# EAGLE design Main (EAGLE 6.1)
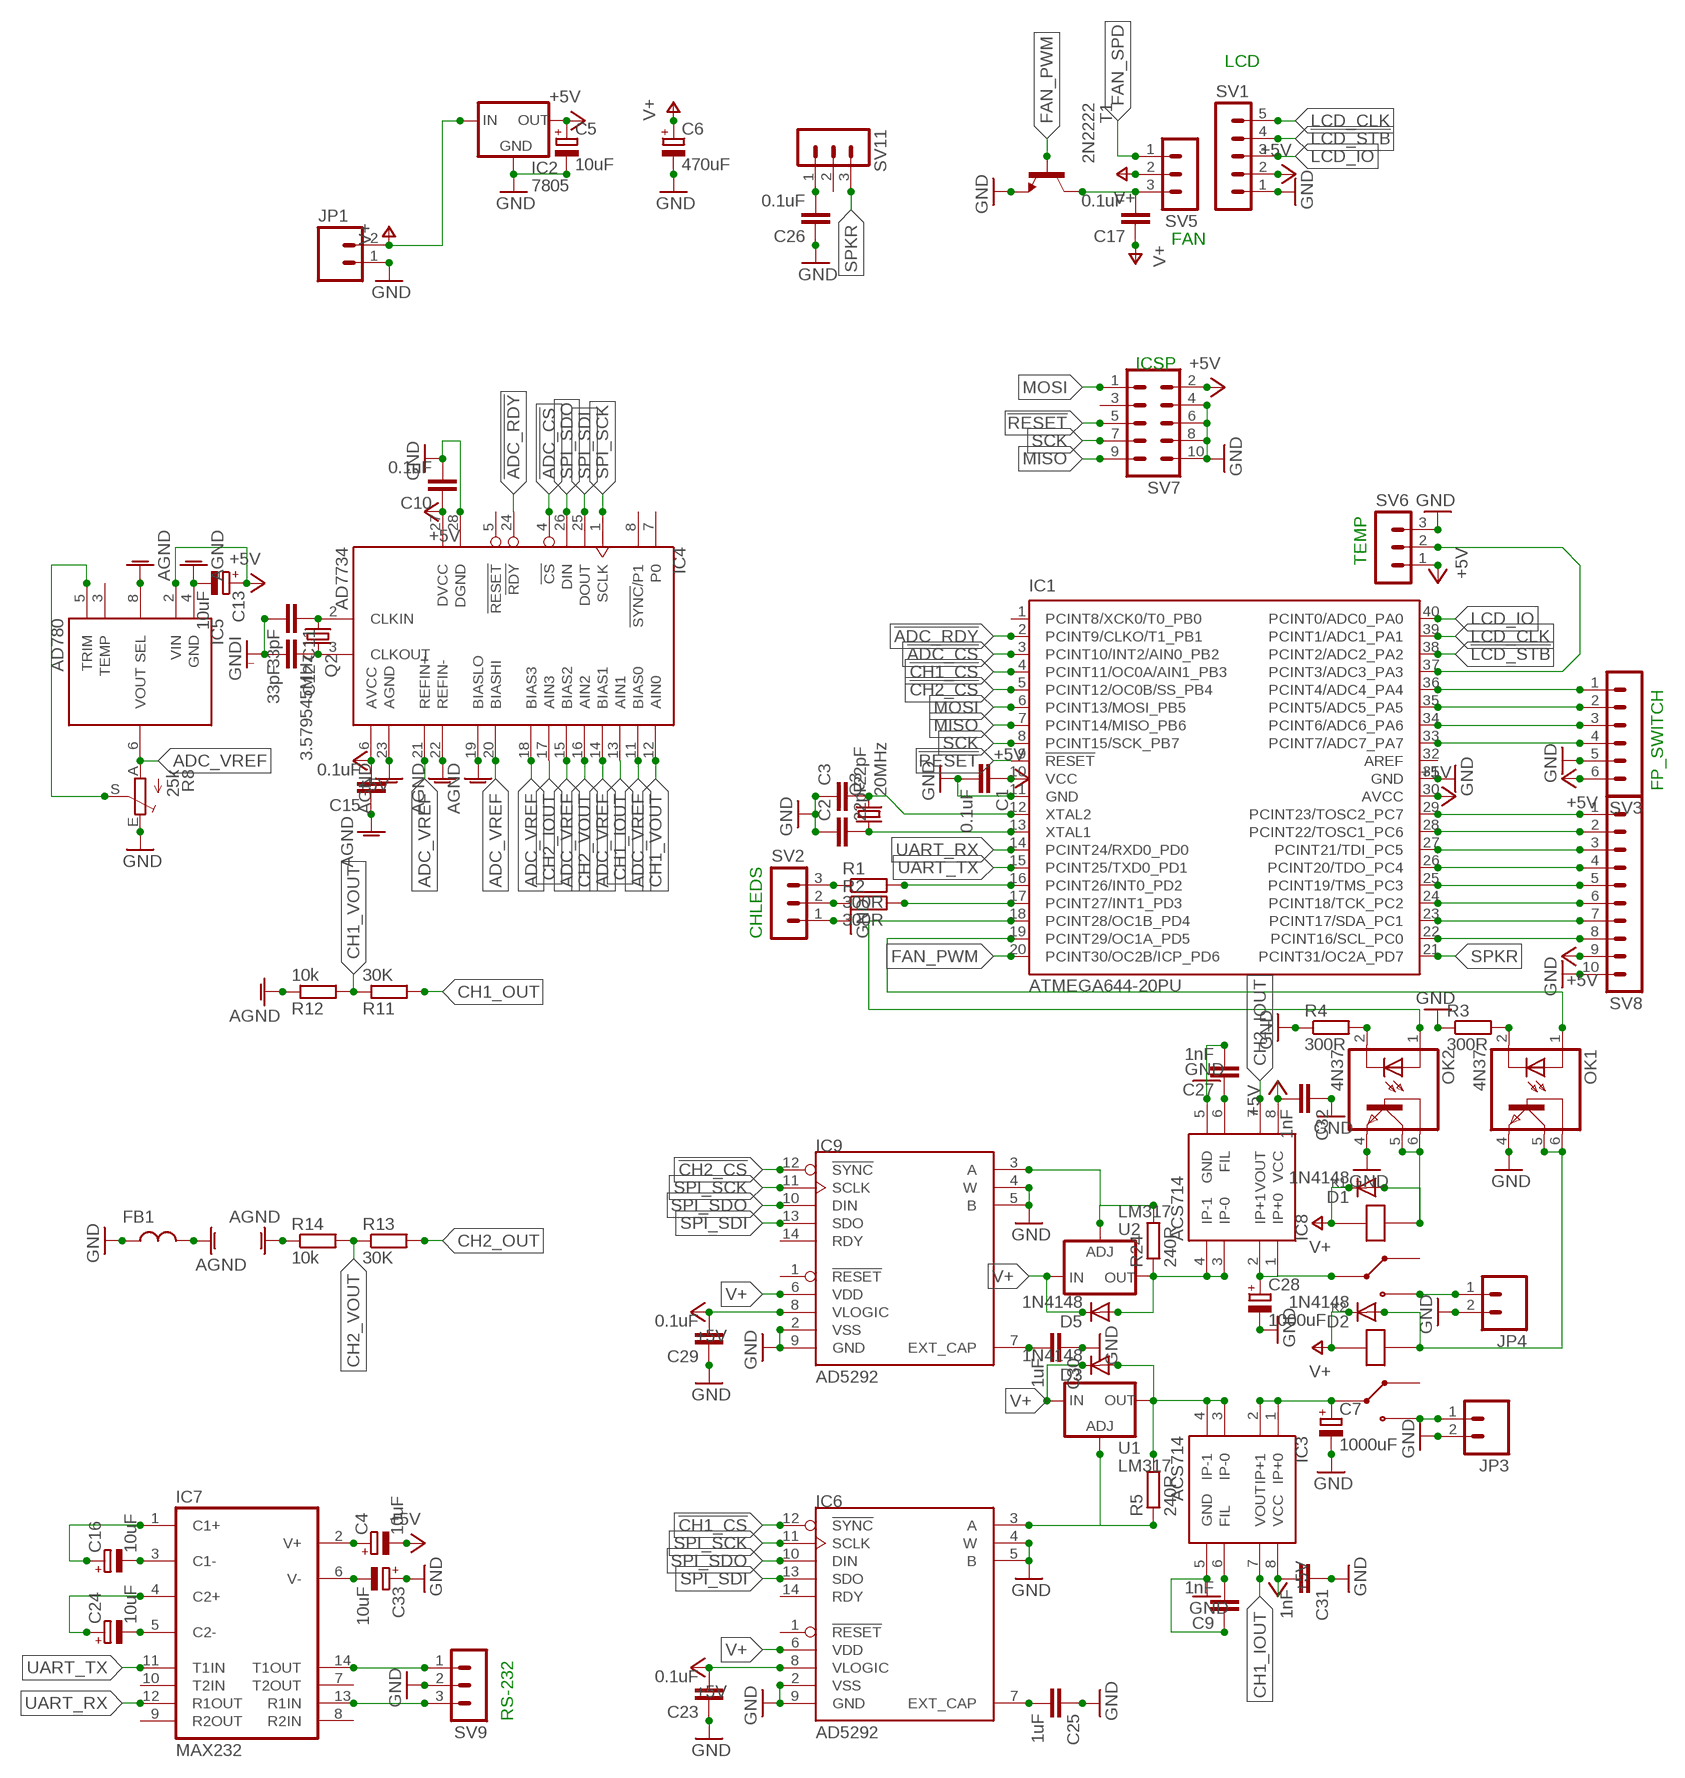
[diagram p0: schematic, sheet 1]

## Parts
C1  0.1uF  C-EUC2012  [C2012]
C2  22pF  C-EU025-024X044  [C025-024X044]
C3  22pF  C-EU025-024X044  [C025-024X044]
C4  10uF  CPOL-EUE2.5-5  [E2,5-5]
C5  10uF  CPOL-EUE2.5-5  [E2,5-5]
C6  470uF  CPOL-EUE5-10.5  [E5-10,5]
C7  1000uF  CPOL-EUE5-13  [E5-13]
C9  1nF  C-EUC2012  [C2012]
C10  0.1uF  C-EUC2012  [C2012]
C11  33pF  C-EUC2012  [C2012]
C12  33pF  C-EUC2012  [C2012]
C13  10uF  CPOL-EUE2.5-5  [E2,5-5]
C15  0.1uF  C-EUC2012  [C2012]
C16  10uF  CPOL-EUE2.5-5  [E2,5-5]
C17  0.1uF  C-EUC2012  [C2012]
C23  0.1uF  C-EUC2012  [C2012]
C24  10uF  CPOL-EUE2.5-5  [E2,5-5]
C25  1uF  C-EUC2012  [C2012]
C26  0.1uF  C-EUC2012  [C2012]
C27  1nF  C-EUC2012  [C2012]
C28  1000uF  CPOL-EUE5-13  [E5-13]
C29  0.1uF  C-EUC2012  [C2012]
C30  1uF  C-EUC2012  [C2012]
C31  1nF  C-EUC2012  [C2012]
C32  1nF  C-EUC2012  [C2012]
C33  10uF  CPOL-EUE2.5-5  [E2,5-5]
D1  1N4148  1N4148DO35-7  [DO35-7]
D2  1N4148  1N4148DO35-7  [DO35-7]
D3  1N4148  1N4148DO35-7  [DO35-7]
D5  1N4148  1N4148DO35-7  [DO35-7]
FB1  FERRITE2012  [R2012]
IC1  ATMEGA644-20PU  [DIL40]
IC2  7805  78MXXS  [78MXXS]
IC3  ACS714  ACS714SOIC8  [SOP08]
IC4  AD7734  AD7734TSSOP28  [TSSOP28]
IC5  AD780  [SOP08]
IC6  AD5292  AD5292TSSOP14  [TSSOP14]
IC7  MAX232  [DIL16]
IC8  ACS714  ACS714SOIC8  [SOP08]
IC9  AD5292  AD5292TSSOP14  [TSSOP14]
JP1  M023.5MM  [SCREWTERMINAL-3.5MM-2]
JP3  M023.5MM  [SCREWTERMINAL-3.5MM-2]
JP4  M023.5MM  [SCREWTERMINAL-3.5MM-2]
K1  SRD-24VDC-SL-C  [SRD-24VDC-SL-C]
K2  SRD-24VDC-SL-C  [SRD-24VDC-SL-C]
OK1  4N37  [DIL06]
OK2  4N37  [DIL06]
Q2  3.579545MHz  CRYSTALHC49S  [HC49/S]
Q3  20MHz  CRYSTALHC49S  [HC49/S]
R1  300R  R-EU_R2012  [R2012]
R2  300R  R-EU_R2012  [R2012]
R3  300R  R-EU_R2012  [R2012]
R4  300R  R-EU_R2012  [R2012]
R5  240R  R-EU_0204/7  [0204/7]
R8  25k  TRIM_EU-B25P  [B25P]
R11  30K  R-EU_R2012  [R2012]
R12  10k  R-EU_R2012  [R2012]
R13  30K  R-EU_R2012  [R2012]
R14  10k  R-EU_R2012  [R2012]
R24  240R  R-EU_0204/7  [0204/7]
SV1  MA05-1  [MA05-1]
SV2  MA03-1  [MA03-1]
SV3  MA06-1  [MA06-1]
SV5  MA03-1  [MA03-1]
SV6  MA03-1  [MA03-1]
SV7  MA05-2  [MA05-2]
SV8  MA10-1  [MA10-1]
SV9  MA03-1  [MA03-1]
SV11  MA03-1  [MA03-1]
T1  2N2222  -NPN-TO92  [TO92]
U1  LM317  V_REG_317SINK  [TO220-ADJ]
U2  LM317  V_REG_317SINK  [TO220-ADJ]

## Nets
!ADC_CS!: IC1.3(PCINT10/INT2/AIN0_PB2) IC4.4(!CS!)
!ADC_RDY!: IC1.2(PCINT9/CLKO/T1_PB1) IC4.24(!RDY!)
!CH1_CS!: IC1.4(PCINT11/OC0A/AIN1_PB3) IC6.12(!SYNC!)
!CH2_CS!: IC1.5(PCINT12/OC0B/SS_PB4) IC9.12(!SYNC!)
!LCD_STB!: IC1.38(PCINT2/ADC2_PA2) SV1.4
!RESET!: IC1.9(!RESET) SV7.5
+5V: C1.1 C4.- C5.+ C10.1 C13.+ C15.2 C23.2 C29.2 C31.2 C32.2 IC1.10(VCC) IC1.30(AVCC) IC2.OUT IC3.8(VCC) IC4.6(AVCC) IC4.27(DVCC) IC5.2(VIN) IC6.8(VLOGIC) IC8.8(VCC) IC9.8(VLOGIC) SV1.2 SV3.6 SV6.1 SV7.2 SV8.9
ADC_VREF: IC4.11(BIAS0) IC4.14(BIAS1) IC4.15(BIAS2) IC4.18(BIAS3) IC4.20(BIASHI) IC4.21(REFIN+) IC5.6(VOUT) R8.A
AGND: C13.- C15.1 FB1.2 IC4.19(BIASLO) IC4.22(REFIN-) IC4.23(AGND) IC5.4(GND) IC5.8(SEL) R12.1 R14.1
CH1_IOUT: IC3.7(VOUT) IC4.13(AIN1)
CH1_OUT: C7.+ IC3.1(IP+0) IC3.2(IP+1) K2.C(IN) R11.2
CH1_VOUT: IC4.12(AIN0) R11.1 R12.2
CH2_IOUT: IC4.17(AIN3) IC8.7(VOUT)
CH2_OUT: C28.+ IC8.1(IP+0) IC8.2(IP+1) K1.C(IN) R13.2
CH2_VOUT: IC4.16(AIN2) R13.1 R14.2
FAN_PWM: IC1.20(PCINT30/OC2B/ICP_PD6) T1.2(B)
FAN_SPD: SV5.1
GND: C1.2 C2.1 C3.1 C5.- C6.- C26.1 C33.+ IC1.11(GND) IC1.31(GND) IC2.GND JP1.1 JP3.2 JP4.2 OK1.4(EMI) OK2.4(EMI) R3.1 R4.1 R8.E SV1.1 SV2.1 SV3.5 SV6.3 SV7.4 SV7.6 SV7.8 SV7.10 SV8.10 SV9.2 T1.1(E)
GNDI: C7.- C9.1 C10.2 C11.2 C12.2 C23.1 C25.1 C27.2 C28.- C29.1 C30.1 C31.1 C32.1 FB1.1 IC3.5(GND) IC4.28(DGND) IC6.2(VSS) IC6.4(W) IC6.5(B) IC6.9(GND) IC8.5(GND) IC9.2(VSS) IC9.4(W) IC9.5(B) IC9.9(GND) ; supply symbol labelled GND
LCD_CLK: IC1.39(PCINT1/ADC1_PA1) SV1.5
LCD_IO: IC1.40(PCINT0/ADC0_PA0) SV1.3
MISO: IC1.7(PCINT14/MISO_PB6) SV7.9
MOSI: IC1.6(PCINT13/MOSI_PB5) SV7.1
N$1: C3.2 IC1.12(XTAL2) Q3.2
N$2: C2.2 IC1.13(XTAL1) Q3.1
N$3: IC1.18(PCINT28/OC1B_PD4) OK2.1(A)
N$4: IC1.19(PCINT29/OC1A_PD5) OK1.1(A)
N$5: IC1.37(PCINT3/ADC3_PA3) SV6.2
N$6: IC1.17(PCINT27/INT1_PD3) R2.2
N$7: R1.1 SV2.3
N$8: R2.1 SV2.2
N$9: C26.2 SV11.1
N$11: IC1.33(PCINT7/ADC7_PA7) SV3.4
N$13: IC1.16(PCINT26/INT0_PD2) R1.2
N$14: IC1.29(PCINT23/TOSC2_PC7) SV8.1
N$15: IC1.28(PCINT22/TOSC1_PC6) SV8.2
N$16: IC1.27(PCINT21/TDI_PC5) SV8.3
N$17: OK1.2(C) R3.2
N$18: OK2.2(C) R4.2
N$19: IC1.26(PCINT20/TDO_PC4) SV8.4
N$20: IC1.25(PCINT19/TMS_PC3) SV8.5
N$21: D1.A K1.1 OK2.5(COL) OK2.6(BAS)
N$22: D2.A K2.1 OK1.5(COL) OK1.6(BAS)
N$26: D3.A IC3.3(IP-0) IC3.4(IP-1) R5.2 U1.OUT
N$27: C17.2 SV5.3 T1.3(C)
N$28: IC1.24(PCINT18/TCK_PC2) SV8.6
N$29: C9.2 IC3.6(FIL)
N$30: IC1.23(PCINT17/SDA_PC1) SV8.7
N$31: C12.1 IC4.3(CLKOUT) Q2.2
N$32: C11.1 IC4.2(CLKIN) Q2.1
N$33: IC5.5(TRIM) R8.S
N$34: IC1.22(PCINT16/SCL_PC0) SV8.8
N$37: C24.- IC7.5(C2-)
N$38: C16.- IC7.3(C1-)
N$39: C25.2 IC6.7(EXT_CAP)
N$40: IC6.3(A) R5.1 U1.ADJ
N$41: JP4.1 K1.NO
N$42: JP3.1 K2.NO
N$43: C27.1 IC8.6(FIL)
N$44: D5.A IC8.3(IP-0) IC8.4(IP-1) R24.1 U2.OUT
N$45: C24.+ IC7.4(C2+)
N$46: C30.2 IC9.7(EXT_CAP)
N$47: IC9.3(A) R24.2 U2.ADJ
N$48: C16.+ IC7.1(C1+)
N$49: C33.- IC7.6(V-)
N$50: C4.+ IC7.2(V+)
ROT_A: IC1.36(PCINT4/ADC4_PA4) SV3.1
ROT_B: IC1.35(PCINT5/ADC5_PA5) SV3.2
ROT_BTN: IC1.34(PCINT6/ADC6_PA6) SV3.3
RS232_RX: IC7.13(R1IN) SV9.3
RS232_TX: IC7.14(T1OUT) SV9.1
SCK: IC1.8(PCINT15/SCK_PB7) SV7.7
SPI_SCK: IC4.1(SCLK) IC6.11(SCLK) IC9.11(SCLK)
SPI_SDI: IC4.25(DOUT) IC6.13(SDO) IC9.13(SDO)
SPI_SDO: IC4.26(DIN) IC6.10(DIN) IC9.10(DIN)
SPKR: IC1.21(PCINT31/OC2A_PD7) SV11.3
UART_RX: IC1.14(PCINT24/RXD0_PD0) IC7.12(R1OUT)
UART_TX: IC1.15(PCINT25/TXD0_PD1) IC7.11(T1IN)
V+: C6.+ C17.1 D1.C D2.C D3.C D5.C IC2.IN IC6.6(VDD) IC9.6(VDD) JP1.2 K1.2 K2.2 SV5.2 U1.IN U2.IN
Unconnected: IC1.1(PCINT8/XCK0/T0_PB0) IC1.32(AREF) IC4.5(!RESET!) IC4.7(P0) IC4.8(!SYNC!/P1) IC5.3(TEMP) IC6.14(RDY) IC7.7(T2OUT) IC7.8(R2IN) IC7.9(R2OUT) IC7.10(T2IN) IC9.14(RDY) K1.NC K2.NC SV7.3 SV11.2

## Notes on the sheet
- LCD
- FAN
- ICSP
- TEMP
- FP_SWITCH
- CHLEDS
- RS-232

## Power pins joined to a net without a drawn wire
!RESET!: IC6.1(!RESET!) IC9.1(!RESET!)
GND: IC7.15(GND)
VCC: IC7.16(VCC)

## Library data of the parts
C1-C3 C9-C12 C15 C17 C23 C25-C27 C29-C32 = rcl:C-EU: CAPACITOR, European symbol
C4-C7 C13 C16 C24 C28 C33 = rcl:CPOL-EU: POLARIZED CAPACITOR, European symbol
D1-D3 D5 = diode:1N4148: DIODE high speed (Philips)
FB1 = Particulates:FERRITE
IC1 = atmel:ATMEGA644-*PU: 8-bit Microcontroller with 64K Bytes In-System Programmable Flash Auto generated by make-symbol-device-package-bsdl.ulp Rev. 34 Source: http://www.atmel.com/dyn/resources/prod_documents/doc2593.pdf; MPN: ATMEGA644-20PU; OC_FARNELL: 1288340; OC_NEWARK: 23M5060
IC2 = v-reg:78MXXS: VOLTAGE REGULATOR
IC3 IC8 = Particulates:ACS714
IC4 = Particulates:AD7734: 4 Channel 24-bit ∑-∆ ADC
IC5 = Particulates:AD780: 2.5V/3V Voltage Reference
IC6 IC9 = Particulates:AD5292: 256-/1024-Position, Digital Potentiometer
IC7 = maxim:MAX232: RS232 TRANSEIVER; MF: MAXIM; MPN: MAX232ACPE+; OC_FARNELL: 9723773; OC_NEWARK: 68K4544
JP1 JP3 JP4 = SparkFun:M02: Header 2 Standard 2-pin 0.1" header. Use with straight break away headers (SKU : PRT-00116), right angle break away headers (PRT-00553), swiss pins (PRT-00743), machine pins (PRT-00117), and female headers (PRT-00115). Molex polarized connector foot print use with SKU : PRT-08233 with associated crimp pins and housings.
K1 K2 = Particulates:SRD-24VDC-SL-C
OK1 OK2 = optocoupler:4N37: OPTO COUPLER Source: http://www.fairchildsemi.com/pf/4N/4N35-M.html; MF: FAIRCHILD SEMICONDUCTOR; MPN: 4N37; OC_FARNELL: 1612456; OC_NEWARK: 72K9948
Q2 Q3 = crystal:CRYSTAL: CRYSTAL; OC_FARNELL: 1667008; OC_NEWARK: unknown
R1-R5 R11-R14 R24 = rcl:R-EU_: RESISTOR, European symbol
R8 = pot:TRIM_EU-: POTENTIOMETER
SV1 = con-lstb:MA05-1: PIN HEADER; OC_FARNELL: unknown; OC_NEWARK: unknown
SV2 SV5 SV6 SV9 SV11 = con-lstb:MA03-1: PIN HEADER; OC_FARNELL: unknown; OC_NEWARK: unknown
SV3 = con-lstb:MA06-1: PIN HEADER; OC_FARNELL: unknown; OC_NEWARK: unknown
SV7 = con-lstb:MA05-2: PIN HEADER; OC_FARNELL: unknown; OC_NEWARK: unknown
SV8 = con-lstb:MA10-1: PIN HEADER; OC_FARNELL: unknown; OC_NEWARK: unknown
T1 = transistor:*-NPN-: NPN Transistror BF959 corrected 2008.03.06
U1 U2 = SparkFun:V_REG_317: Voltage Regulator Standard LM317 adjustable voltage regulator. AOI (Adjust Output Input). Google 'LM317 Calculator' for easy to use app to get the two resistor values needed. 240/720 for 5V output. 240/390 for 3.3V output. Spark Fun Electronics SKU : COM-00527

## Board
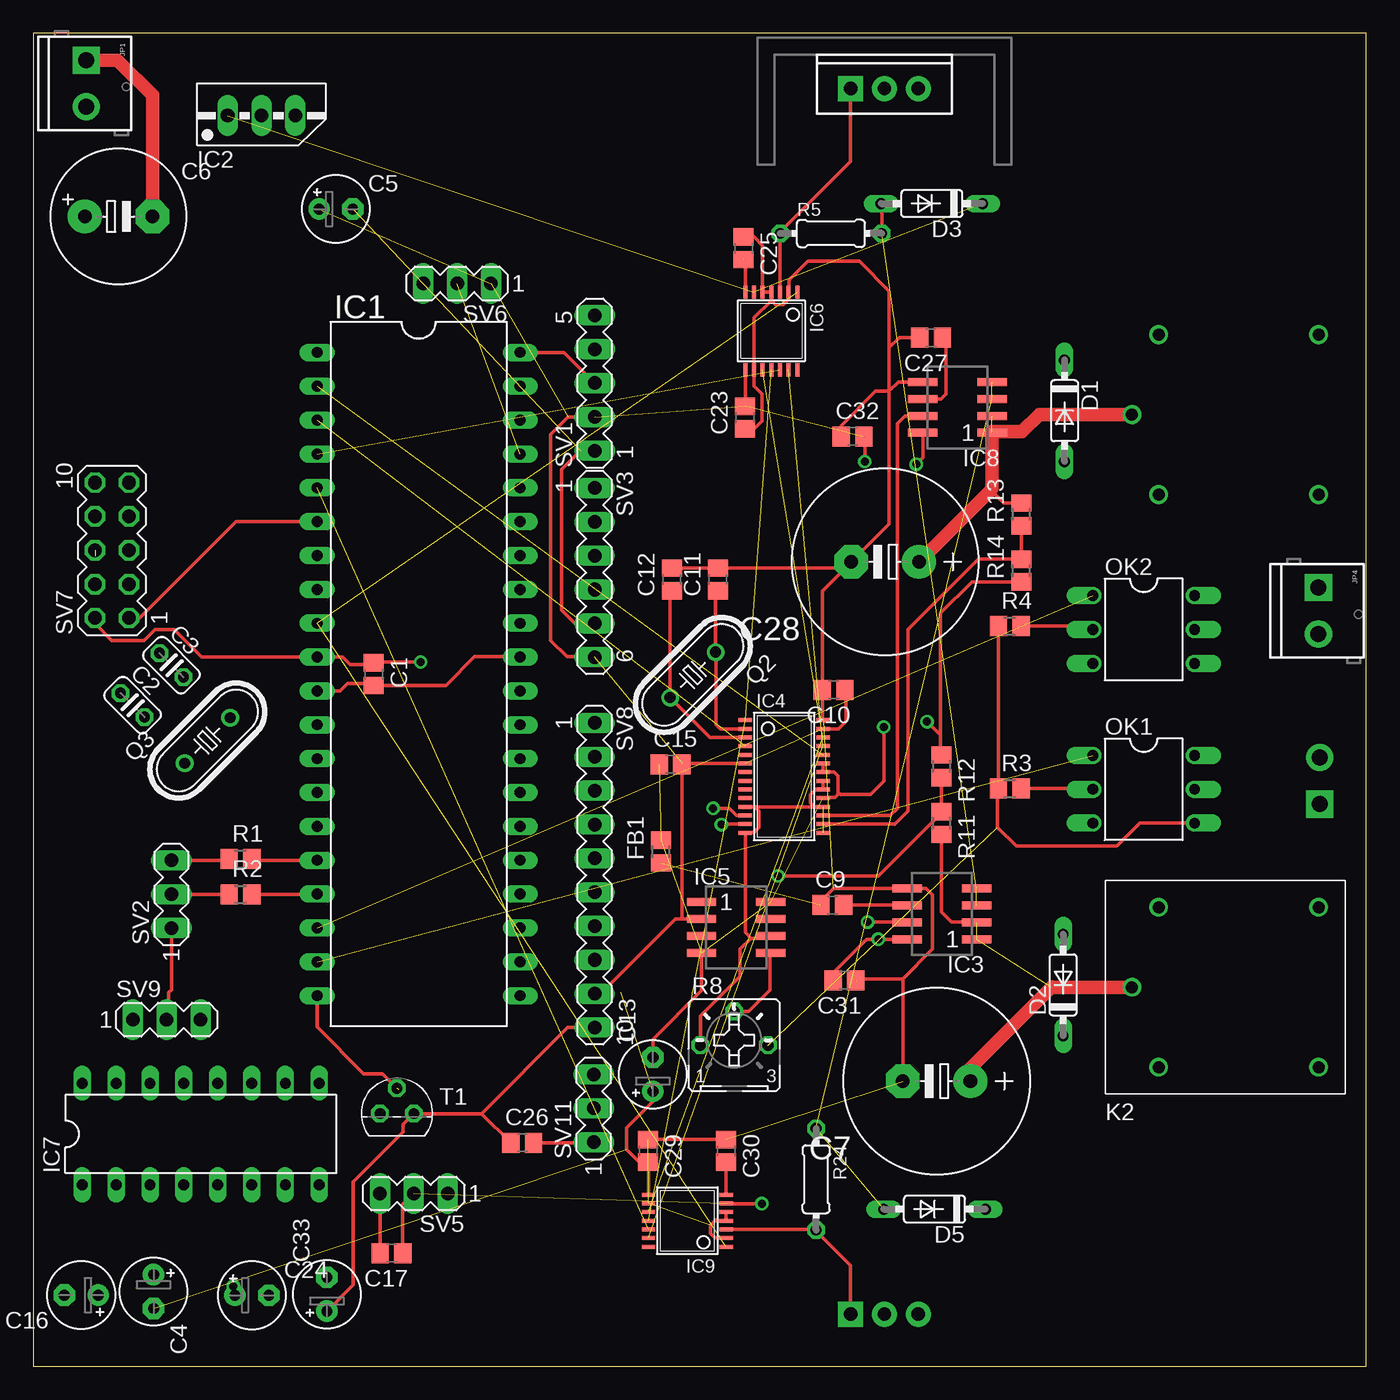
[diagram p1: board, top side]
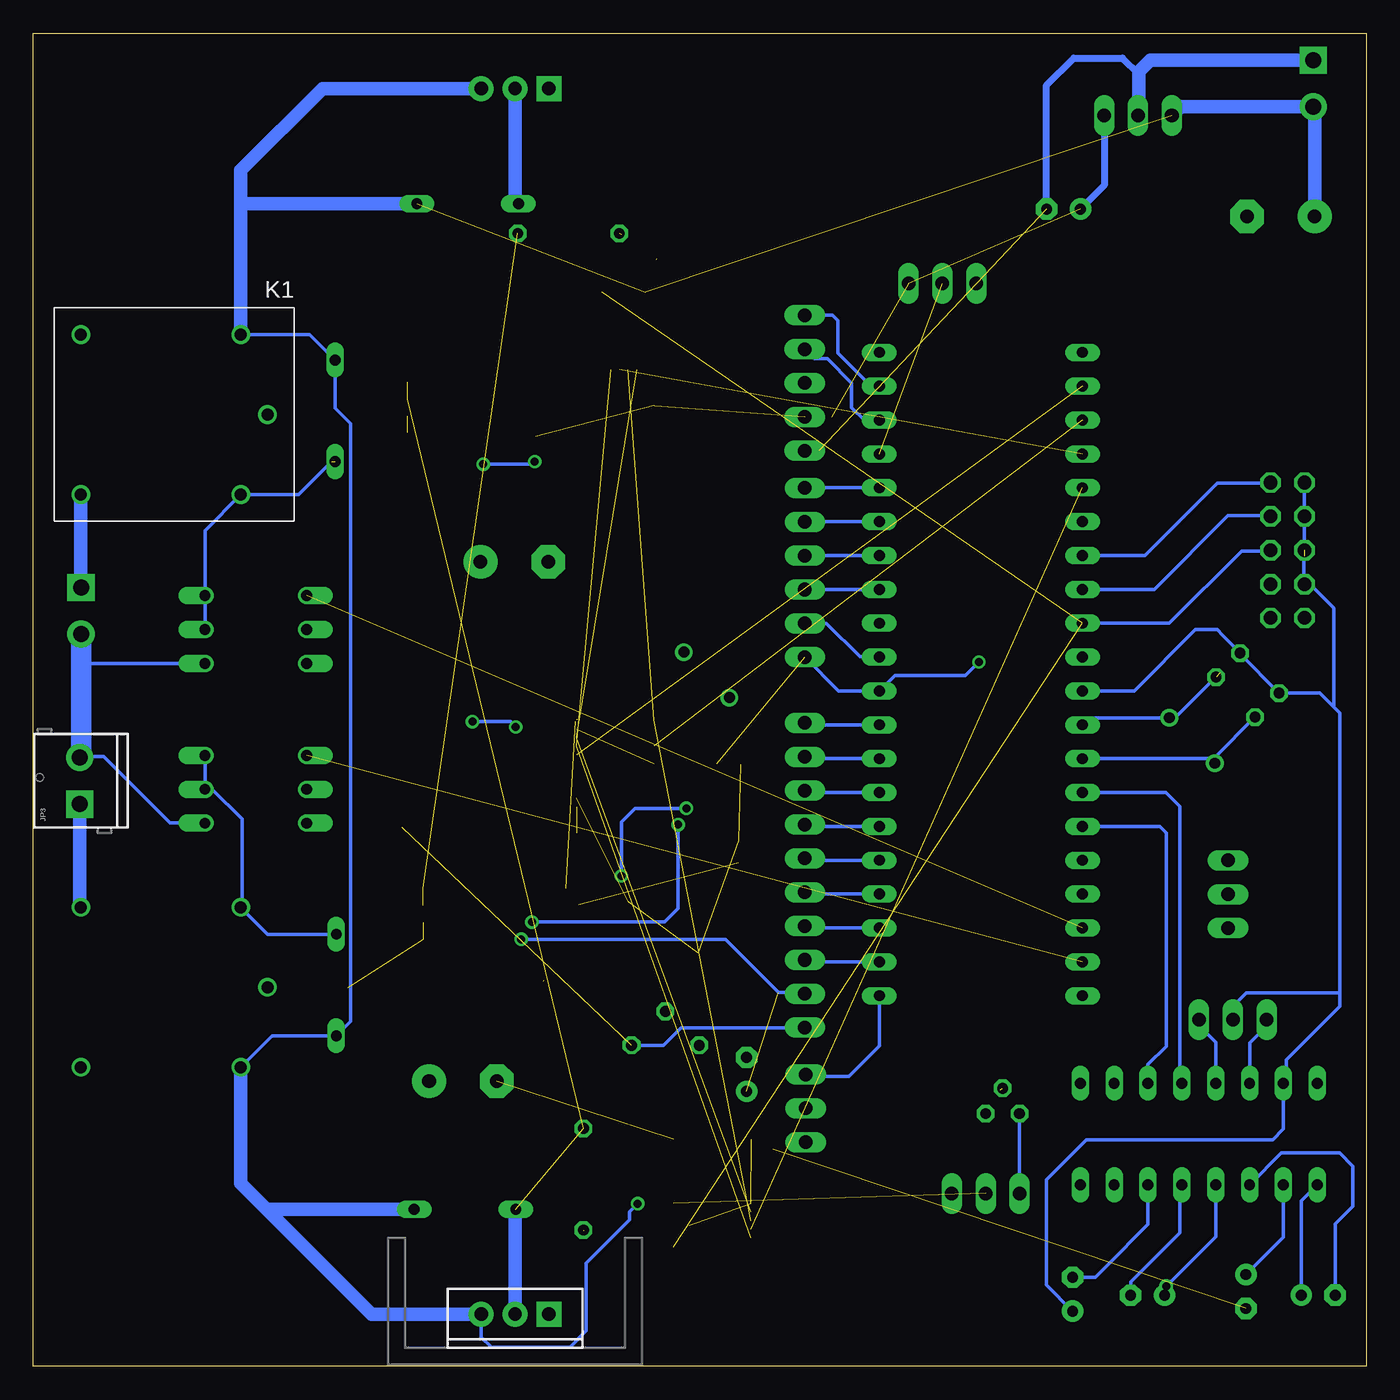
[diagram p2: board, bottom side, seen from below]

Size 100 x 100 mm. Coordinates in mm from the lower left corner, seen from the top.
Outline: 0,0 100,0 100,100 0,100 0,0
Copper layers (1*16): Top 0.035mm / dielectric 1.5mm / Bottom 0.035mm
Design rules: minimum track width 10mil, minimum drill 24mil, track to track 8mil, track to pad 8mil, pad to pad 8mil, via to via 8mil, smd to smd 8mil, copper to edge 40mil, drill to drill 8mil, minimum pad ring 10mil, minimum via ring 8mil, stop-mask expansion 4mil, vias tented up to drill 0mil, thermal gap 10mil

### Footprints (pad centres in the part's own frame; a part is rotated, then mirrored left to right if it is on the bottom)
C2012 = smd 1.3 x 1.5: 1 -0.85,0; 2 0.85,0
C025-024X044 = drill 0.813 octagon: 1 -1.27,0; 2 1.27,0
E2,5-5 = drill 0.813 pad 1.6: + -1.27,0 | drill 0.813 pad 1.6 octagon: - 1.27,0
E5-10,5 = drill 1.016 pad 2.54: + -2.54,0 | drill 1.016 pad 2.54 octagon: - 2.54,0
E5-13 = drill 1.016 pad 2.54: + -2.54,0 | drill 1.016 pad 2.54 octagon: - 2.54,0
DO35-7 = drill 0.813 long: A 3.81,0; C -3.81,0
R2012 = smd 1.3 x 1.5: 1 -0.85,0; 2 0.85,0
DIL40 = drill 0.813 long: 1 -24.13,-7.62; 2 -21.59,-7.62; 3 -19.05,-7.62; 4 -16.51,-7.62; 5 -13.97,-7.62; 6 -11.43,-7.62; 7 -8.89,-7.62; 8 -6.35,-7.62; 9 -3.81,-7.62; 10 -1.27,-7.62; 11 1.27,-7.62; 12 3.81,-7.62; 13 6.35,-7.62; 14 8.89,-7.62; 15 11.43,-7.62; 16 13.97,-7.62; 17 16.51,-7.62; 18 19.05,-7.62; 19 21.59,-7.62; 20 24.13,-7.62; 21 24.13,7.62; 22 21.59,7.62; 23 19.05,7.62; 24 16.51,7.62; 25 13.97,7.62; 26 11.43,7.62; 27 8.89,7.62; 28 6.35,7.62; 29 3.81,7.62; 30 1.27,7.62; 31 -1.27,7.62; 32 -3.81,7.62; 33 -6.35,7.62; 34 -8.89,7.62; 35 -11.43,7.62; 36 -13.97,7.62; 37 -16.51,7.62; 38 -19.05,7.62; 39 -21.59,7.62; 40 -24.13,7.62
78MXXS = drill 1.016 long: GND 0,-2.54; IN -2.54,-2.54; OUT 2.54,-2.54
SOP08 = smd 0.6 x 2.2: 1 -1.905,-2.6; 2 -0.635,-2.6; 3 0.635,-2.6; 4 1.905,-2.6; 5 1.905,2.6; 6 0.635,2.6; 7 -0.635,2.6; 8 -1.905,2.6
TSSOP28 = smd 0.305 x 0.991: 1 -4.225,-2.918; 2 -3.575,-2.918; 3 -2.925,-2.918; 4 -2.275,-2.918; 5 -1.625,-2.918; 6 -0.975,-2.918; 7 -0.325,-2.918; 8 0.325,-2.918; 9 0.975,-2.918; 10 1.625,-2.918; 11 2.275,-2.918; 12 2.925,-2.918; 13 3.575,-2.918; 14 4.225,-2.918; 15 4.225,2.918; 16 3.575,2.918; 17 2.925,2.918; 18 2.275,2.918; 19 1.625,2.918; 20 0.975,2.918; 21 0.325,2.918; 22 -0.325,2.918; 23 -0.975,2.918; 24 -1.625,2.918; 25 -2.275,2.918; 26 -2.925,2.918; 27 -3.575,2.918; 28 -4.225,2.918
TSSOP14 = smd 0.305 x 0.991: 1 -1.95,-2.918; 2 -1.3,-2.918; 3 -0.65,-2.918; 4 0,-2.918; 5 0.65,-2.918; 6 1.3,-2.918; 7 1.95,-2.918; 8 1.95,2.918; 9 1.3,2.918; 10 0.65,2.918; 11 0,2.918; 12 -0.65,2.918; 13 -1.3,2.918; 14 -1.95,2.918
DIL16 = drill 0.813 long: 1 -8.89,-3.81; 2 -6.35,-3.81; 3 -3.81,-3.81; 4 -1.27,-3.81; 5 1.27,-3.81; 6 3.81,-3.81; 7 6.35,-3.81; 8 8.89,-3.81; 9 8.89,3.81; 10 6.35,3.81; 11 3.81,3.81; 12 1.27,3.81; 13 -1.27,3.81; 14 -3.81,3.81; 15 -6.35,3.81; 16 -8.89,3.81
SCREWTERMINAL-3.5MM-2 = drill 1.2 pad 2.032 square: 1 0,0 | drill 1.2 pad 2.032: 2 3.5,0
SRD-24VDC-SL-C = drill 0.9: 1 2,6; 2 2,-6; C 0,0; NC 14,-6; NO 14,6
DIL06 = drill 0.813 offset: 1 -2.54,-3.81; 2 0,-3.81; 3 2.54,-3.81; 4 2.54,3.81; 5 0,3.81; 6 -2.54,3.81
HC49/S = drill 0.813: 1 -2.413,0; 2 2.413,0
0204/7 = drill 0.813 octagon: 1 -3.81,0; 2 3.81,0
B25P = drill 0.813 octagon: A -2.54,0; E 2.54,0; S 0,2.54
MA05-1 = drill 1.016 long: 1 -5.08,0; 2 -2.54,0; 3 0,0; 4 2.54,0; 5 5.08,0
MA03-1 = drill 1.016 long: 1 -2.54,0; 2 0,0; 3 2.54,0
MA06-1 = drill 1.016 long: 1 -6.35,0; 2 -3.81,0; 3 -1.27,0; 4 1.27,0; 5 3.81,0; 6 6.35,0
MA05-2 = drill 1.016 octagon: 1 -5.08,-1.27; 2 -5.08,1.27; 3 -2.54,-1.27; 4 -2.54,1.27; 5 0,-1.27; 6 0,1.27; 7 2.54,-1.27; 8 2.54,1.27; 9 5.08,-1.27; 10 5.08,1.27
MA10-1 = drill 1.016 long: 1 -11.43,0; 2 -8.89,0; 3 -6.35,0; 4 -3.81,0; 5 -1.27,0; 6 1.27,0; 7 3.81,0; 8 6.35,0; 9 8.89,0; 10 11.43,0
TO92 = drill 0.813 octagon: 1 1.27,0; 2 0,1.905; 3 -1.27,0
TO220-ADJ = drill 1 pad 1.88 square: ADJ -2.54,0 | drill 1 pad 1.88: IN 2.54,0; OUT 0,0

### Placement (x,y rotation side)
C1  25.54,51.92 270 top
C2  7.44,49.6 315 top
C3  10.36,52.6 315 top
C4  9.02,5.6 270 top
C5  22.71,86.82 0 top
C6  6.4,86.26 0 top
C7  67.77,21.39 180 top
C9  59.94,34.59 0 top
C10  60.05,50.75 180 top
C11  51.36,59.03 90 top
C12  47.9,59.03 90 top
C13  46.48,21.89 90 top
C15  47.8,45.16 0 top
C16  3.6,5.33 180 top
C17  26.87,8.48 180 top
C23  53.39,71.17 90 top
C24  16.4,5.32 0 top
C25  53.29,83.87 270 top
C26  36.68,16.77 0 top
C27  67.36,77.16 180 top
C28  63.91,60.35 180 top
C29  46.13,16.16 270 top
C30  51.97,16.16 270 top
C31  60.86,28.95 180 top
C32  61.47,69.75 0 top
C33  22.03,5.4 90 top
D1  77.37,71.68 270 top
D2  77.27,28.6 90 top
D3  67.41,87.22 180 top
D5  67.62,11.78 180 top
FB1  47.09,38.61 90 top
IC1  28.91,51.93 270 top
IC2  17.12,96.37 0 top
IC3  68.17,33.93 90 top
IC4  56.34,44.25 270 top
IC5  52.73,32.92 270 top
IC6  55.37,77.67 180 top
IC7  12.56,17.42 0 top
IC8  69.34,71.93 90 top
IC9  49.07,10.92 90 top
JP1  3.96,97.99 270 top
JP3  96.52,42.16 90 bottom
JP4  96.42,58.42 270 top
K1  82.43,71.4 180 bottom
K2  82.43,28.43 0 top
OK1  83.31,43.28 270 top
OK2  83.31,55.27 270 top
Q2  49.48,51.87 225 top
Q3  13.06,46.94 45 top
R1  15.54,38.05 0 top
R2  15.54,35.41 0 top
R3  73.25,43.33 0 top
R4  73.25,55.52 0 top
R5  59.84,84.99 0 top
R8  52.58,24.08 0 top
R11  68.12,40.74 270 top
R12  68.12,45.01 270 top
R13  74.12,63.91 90 top
R14  74.12,59.69 90 top
R24  58.73,14.02 270 top
SV1  42.11,73.76 90 top
SV2  10.36,35.41 90 top
SV3  42.11,59.54 270 top
SV5  28.55,12.95 180 top
SV6  31.8,81.23 180 top
SV7  5.9,61.21 90 top
SV8  42.11,36.83 270 top
SV9  10,26 0 top
SV11  42.04,19.35 90 top
T1  27.28,18.95 0 top
U1  63.86,95.86 0 top
U2  63.86,3.91 180 bottom

### Tracks (layer width: path | path; a pad name or v marks a point on that pad's centre or on a via)
!ADC_CS!  (1 unrouted)
!ADC_RDY!  (1 unrouted)
!CH1_CS!  (1 unrouted)
!CH2_CS!  (1 unrouted)
!LCD_STB!
  Bottom 0.254: IC1.38 37.66,70.98 38.61,71.93 38.61,73.76 40.44,75.59 41.4,75.59 SV1.4
!RESET!  (2 unrouted)
  Bottom 0.254: IC1.9 14.77,55.74 9.35,61.16 7.52,61.16 | 7.52,61.16 7.32,61.16 7.11,60.96 | SV7.5 7.47,61.21 7.52,61.16
+5V  (via drill 0.6)  (8 unrouted)
  Top 0.254: SV7.2 4.63,55.72 5.89,54.46 8.33,54.46 9.14,55.27 10.57,55.27 12.64,53.2 IC1.10 23.2,53.2 23.77,52.63 25.4,52.63 C1.1 25.61,52.83 v29.06,52.83 | SV1.2 40.13,71.22 38.81,69.9 38.81,54.46 40.03,53.24 42.06,53.24 SV3.6 | IC5.2 48.56,33.55 | 48.56,33.55 48.18,33.55 43.08,28.45 42.62,28.45 SV8.9 | IC3.8 v63.4,32.03 62.51,32.03 59.94,29.46 59.94,29.02 C31.2 | IC4.6 48.71,45.22 C15.2 48.65,33.64 48.56,33.55 | IC4.27 60.42,47.82 60.96,48.36 60.96,50.69 C10.1 | IC9.8 46.15,15.29 C29.2 46.07,15.24 45.52,15.24 44.5,16.26 44.5,17.88 46.48,19.86 C13.+ | IC6.8 53.42,72.05 C23.2 | IC8.8 66.74,68.16 v66.24,67.67 | v62.38,67.87 62.38,69.69 C32.2
  Bottom 0.254: v29.06,52.83 30.07,51.82 35.37,51.82 IC1.30 39.58,50.66 SV3.6 | v63.4,32.03 48.08,32.03 44.09,28.04 42.21,28.04 SV8.9 | v66.24,67.67 62.59,67.67 v62.38,67.87
  Bottom 0.508: IC2.OUT 19.66,88.59 C5.+
ADC_VREF  (1 unrouted)
  Top 0.254: R8.A 50.04,26.26 53.03,29.26 53.03,31.29 53.85,32.11 | 53.85,32.11 55.15,32.11 IC5.6 | 53.85,32.11 53.42,32.53 IC4.14 54.05,40.03 54.46,40.44 54.46,41.66 54.14,41.97 IC4.11 IC4.18 58.61,41.97 58.32,42.27 58.32,42.88 58.73,43.28 59.24,43.28 IC4.20 IC4.21
AGND  (via drill 0.6)  (4 unrouted)
  Top 0.254: R14.1 70.42,58.84 68.07,56.49 68.07,47.35 | R12.1 68.07,45.91 68.07,47.35 | IC4.23 IC4.22 60.08,44.57 60.35,44.3 60.35,43.08 | 60.35,43.08 60.35,42.88 60.15,42.67 59.3,42.67 IC4.19 | 68.07,47.35 v67.06,48.36 | v63.8,47.95 63.8,43.89 62.79,42.88 60.55,42.88 60.35,43.08 | IC5.4 50.13,28.18 46.48,24.54 C13.-
  Bottom 0.254: v67.06,48.36 64.21,48.36 v63.8,47.95
CH1_IOUT  (via drill 0.6)
  Top 0.254: IC4.13 51.65,40.67 v51.61,40.64 | v62.59,33.33 65.55,33.33 IC3.7
  Bottom 0.254: v51.61,40.64 51.61,34.34 52.63,33.33 v62.59,33.33
CH1_OUT  (2 unrouted)
  Top 0.254: R11.2 68.12,34.09 68.89,33.33 70.75,33.33 IC3.2
  Top 1.016: C7.+ 70.31,22.35 76.39,28.43 | 76.39,28.43 76.4,28.45 | K2.C 76.39,28.43
CH1_VOUT  (via drill 0.6)
  Top 0.254: R12.2 R11.1 68.12,41.5 63.4,36.78 v55.88,36.78 | v51,41.86 52.22,41.86 52.76,41.32 IC4.12
  Bottom 0.254: v55.88,36.78 55.88,40.84 54.86,41.86 v51,41.86
CH2_IOUT
  Top 0.254: IC8.7 65.4,71.3 64.82,70.71 64.82,41.86 64.28,41.32 IC4.17
CH2_OUT  (2 unrouted)
  Top 0.254: R13.2 72.81,64.76 71.73,65.84 71.73,65.63
  Top 1.016: K1.C 75.47,71.4 74.17,70.1 71.93,70.1 | IC8.1 71.94,65.84 71.73,65.63 C28.+
CH2_VOUT
  Top 0.254: R13.1 R14.2 70.9,60.54 65.63,55.27 65.63,41.66 65.02,41.05 64.65,40.67 | 64.65,40.67 64.62,40.64 | IC4.16 64.65,40.67
FAN_PWM  (1 unrouted)
  Top 0.254: IC1.20 21.29,25.45 24.79,21.95 26.21,21.95 27.43,20.73
GND  (4 unrouted)
  Top 0.254: IC1.11 23.02,50.66 23.57,51.21 25.41,51.21 C1.2 30.95,51.07 33.12,53.24 36.49,53.24 IC1.31 | OK1.4 83.01,40.74 81.28,39.01 73.76,39.01 72.34,40.44 72.34,43.27 R3.1 R4.1 | SV1.1 41.05,68.68 39.62,67.26 39.62,56.74 40.64,55.73 SV3.5 | 9.97,27.03 9.97,26.03 SV9.2 10.16,26.16 10.16,28.04 10.36,28.25 SV2.1 | C33.+ 24,6.1 24,13.82 27.76,17.58 27.76,18.16 T1.1 33.65,18.95 | 33.65,18.95 C26.1 | SV8.10 40.1,25.4 33.65,18.95
  Top 1.016: C6.- 8.94,95.35 6.3,97.99 JP1.1
  Bottom 0.254: 2.44,49.44 3.5,50.5 C2.1 9.46,53.42 C3.1 10.77,54.81 11.18,55.27 12.8,55.27 17.41,50.66 IC1.11 | 2,28 2,49 2.44,49.44 | 2,28 2,27 6,23 6,21.44 IC7.15 6.21,17.79 7,17 21,17 24,14 24,6.1 C33.+ | SV9.2 10,27 9,28 2,28 | SV7.10 SV7.8 4.63,60.8 4.67,60.76 4.67,58.72 | 4.67,58.72 SV7.4 | 4.67,58.72 4.26,58.72 2.44,56.9 2.44,49.44 | OK2.4 96.32,52.73 96.42,52.63 | 96.42,45.76 94.73,45.76 89.71,40.74 OK1.4 | SV3.5 40.49,55.73 38,53.24 36.57,53.24 IC1.31 | R8.E 52.73,24.08 51.41,25.4 SV8.10 | SV8.10
  Bottom 0.508: C5.- 23.98,96.11 21.95,98.15 18.29,98.15 17.07,96.93 17.07,95.1 | 17.07,95.1 17.07,94.49 16.87,94.28 | IC2.GND 17.12,95.05 17.07,95.1
  Bottom 1.016: JP1.1 16.2,97.99 17.07,97.13 17.07,93.88 IC2.GND
  Bottom 1.524: JP4.2 96.42,52.63 96.42,45.76 JP3.2
GNDI  (7 unrouted)
  Top 0.254: C9.1 59.54,35.04 59.54,35.36 60.02,35.84 IC3.5 66.98,35.84 67.46,35.36 67.46,31.29 65.23,29.06 | 65.23,29.06 C7.- | C28.- 64.21,63.2 64.21,73.15 | IC8.5 64.9,73.84 64.21,73.15 | C27.2 64.97,77.16 64.21,76.4 | 64.21,73.15 64.21,76.4 | 59.33,48.36 59.2,48.5 C10.2 59.2,58.17 C28.- | C12.2 C11.2 60.9,59.88 C28.- | IC9.5 IC9.4 51.26,10.92 51.21,10.97 50.8,10.57 50.8,9.96 51.14,9.62 IC9.2 | C30.1 C29.1 | C25.1 53.3,84.73 54.05,84.73 54.72,84.06 IC6.5 IC6.4 55.37,79.96 | 55.37,79.96 55.68,79.65 56.29,79.65 56.69,80.06 56.69,80.57 IC6.2 56.69,80.61 56.69,81.48 58.12,82.91 61.98,82.91 64.21,80.67 64.21,76.4 | C23.1 53.4,70.31 54.05,70.31 54.66,70.92 54.66,72.95 54.07,73.54 IC6.9 54.07,78.66 55.37,79.96 | 65.23,29.06 61.98,29.06 61.77,28.85 | C32.1 60.62,70.57 63.2,73.15 64.21,73.15
LCD_CLK
  Bottom 0.254: IC1.39 37.15,73.52 39.62,76 39.62,78.44 40.03,78.84 SV1.5
LCD_IO
  Top 0.254: IC1.40 39.81,76.06 SV1.3
MISO
  Bottom 0.254: IC1.7 16.6,60.82 11.18,66.24 7.22,66.24 SV7.9
MOSI
  Top 0.254: IC1.6 15.2,63.36 7.97,56.13 SV7.1
N$1  (1 unrouted)
  Bottom 0.254: 11,52 14.35,48.65 Q3.2 20.76,48.65 IC1.12
N$2
  Bottom 0.254: IC1.13 11.7,45.58 Q3.1 11.35,45.69 C2.2
N$3  (1 unrouted)
N$4  (1 unrouted)
N$5  (1 unrouted)
N$6
  Top 0.254: R2.2 21.28,35.41 IC1.17
N$7
  Top 0.254: SV2.3 14.59,37.95 R1.1
N$8
  Top 0.254: SV2.2 R2.1
N$9
  Top 0.254: C26.2 42,16.77 SV11.1
N$11
  Bottom 0.254: IC1.33 42.1,58.28 SV3.4
N$13
  Top 0.254: IC1.16 16.48,37.96 R1.2
N$14
  Bottom 0.254: IC1.29 41.97,48.12 SV8.1
N$15
  Bottom 0.254: IC1.28 41.97,45.58 SV8.2
N$16
  Bottom 0.254: IC1.27 41.97,43.04 SV8.3
N$17
  Top 0.254: R3.2 79.45,43.33 OK1.2
N$18
  Top 0.254: R4.2 79.25,55.52 OK2.2
N$19
  Bottom 0.254: IC1.26 41.97,40.5 SV8.4
N$20
  Bottom 0.254: IC1.25 41.97,37.96 SV8.5
N$21  (1 unrouted)
  Bottom 0.254: OK2.5 OK2.6 87.12,62.71 K1.1 80.09,65.4 77.62,67.87
N$22
  Bottom 0.254: OK1.6 OK1.5 86.56,43.28 84.33,41.05 84.33,34.53 K2.1 82.41,32.41 D2.A
N$26  (2 unrouted)
  Top 0.254: R5.2 63.65,87.17 D3.A
  Bottom 1.016: U1.OUT 63.86,87.48 D3.A
N$27
  Top 0.254: C17.2 26.02,12.94 SV5.3
  Bottom 0.254: T1.3 SV5.3
N$28
  Bottom 0.254: IC1.24 41.97,35.42 SV8.6
N$29
  Top 0.254: C9.2 65.55,34.59 IC3.6
N$30
  Bottom 0.254: IC1.23 41.97,32.88 SV8.7
N$31
  Top 0.254: IC4.3 50.76,47.17 Q2.2 47.77,58.05 C12.1
N$32
  Top 0.254: IC4.2 51.54,47.82 51.21,48.16 51.21,53.55 Q2.1 51.19,58.06 C11.1
N$33
  Top 0.254: R8.S 53.65,26.62 55.27,28.25 55.27,30.95 IC5.5
N$34
  Bottom 0.254: IC1.22 41.97,30.34 SV8.8
N$37
  Bottom 0.254: C24.- 17.67,6.33 14,10 14,13.44 IC7.5
N$38
  Bottom 0.254: C16.- 2.33,10.67 1,12 1,15 2,16 6.36,16 IC7.3
N$39  (1 unrouted)
  Top 0.254: IC6.7 53.42,82.92 53.24,83.11
N$40  (1 unrouted)
  Top 0.254: U1.ADJ 61.32,90.37 55.88,84.94 | R5.1 56.03,80.6 IC6.3
N$41
  Bottom 1.016: K1.NO JP4.1
N$42
  Bottom 1.016: JP3.1 96.52,34.52 K2.NO
N$43
  Top 0.254: IC8.6 68.1,72.57 68.48,72.95 68.48,77.01 68.28,77.22 68.27,77.22 C27.1
N$44  (3 unrouted)
  Bottom 1.016: U2.OUT 63.86,11.73 D5.A
N$45  (via drill 0.6)
  Bottom 0.254: IC7.4 11.29,9.71 v15,6 15,5.45 C24.+
N$46
  Top 0.254: IC9.7 51.99,15.29 C30.2
N$47  (1 unrouted)
  Top 0.254: U2.ADJ 61.32,7.57 58.73,10.16 | IC9.3 58.67,10.27 R24.2
N$48
  Bottom 0.254: C16.+ 4.87,12.41 IC7.1
N$49
  Bottom 0.254: IC7.6 16.37,10.63 19.5,7.5 20,7 20.33,6.67 C33.-
N$50
  Bottom 0.254: IC7.2 6.21,9.68 C4.+
ROT_A
  Bottom 0.254: IC1.36 42.1,65.9 SV3.1
ROT_B
  Bottom 0.254: IC1.35 42.1,63.36 SV3.2
ROT_BTN
  Bottom 0.254: IC1.34 42.1,60.82 SV3.3
RS232_RX
  Bottom 0.254: IC7.13 11.29,24.29 12,25 12,25.46 SV9.3
RS232_TX
  Bottom 0.254: IC7.14 8.75,24.25 7.46,25.54 SV9.1
SCK
  Bottom 0.254: IC1.8 15.89,58.28 10.36,63.8 7.22,63.8 SV7.7
SPI_SCK  (2 unrouted)
SPI_SDI  (2 unrouted)
SPI_SDO  (2 unrouted)
SPKR
  Bottom 0.254: IC1.21 36.53,24.02 38.81,21.74 41.9,21.74 SV11.3
UART_RX
  Bottom 0.254: IC1.14 15.04,43.04 14,42 14,21.4 IC7.12
UART_TX
  Bottom 0.254: IC7.11 16.37,22.63 15,24 15,40 15.5,40.5 IC1.15
V+  (via drill 0.6)  (3 unrouted)
  Top 0.254: C17.1 27.72,12.13 SV5.2 | v54.66,12.19 52.02,12.19 IC9.6
  Bottom 0.254: K2.2 82.07,24.79 D2.C 76.2,25.86 76.2,70.71 77.37,71.88 D1.C 79.28,77.4 K1.2 | U2.IN 66.4,2.18 65.63,1.42 59.74,1.42 58.52,2.64 58.52,7.72 55.27,10.97 55.27,11.58 v54.66,12.19
  Bottom 1.016: U2.IN 74.62,3.91 82.49,11.78 | 82.49,11.78 84.43,13.72 K2.2 | U1.IN 78.28,95.86 84.43,89.71 84.43,87.17 | 84.43,87.17 K1.2 | IC2.IN 13.91,94.49 JP1.2 3.86,94.39 C6.+ | D3.C 84.38,87.22 84.43,87.17 | D5.C 82.49,11.78